# Altium project foc_driver-V0.5.PrjPcb
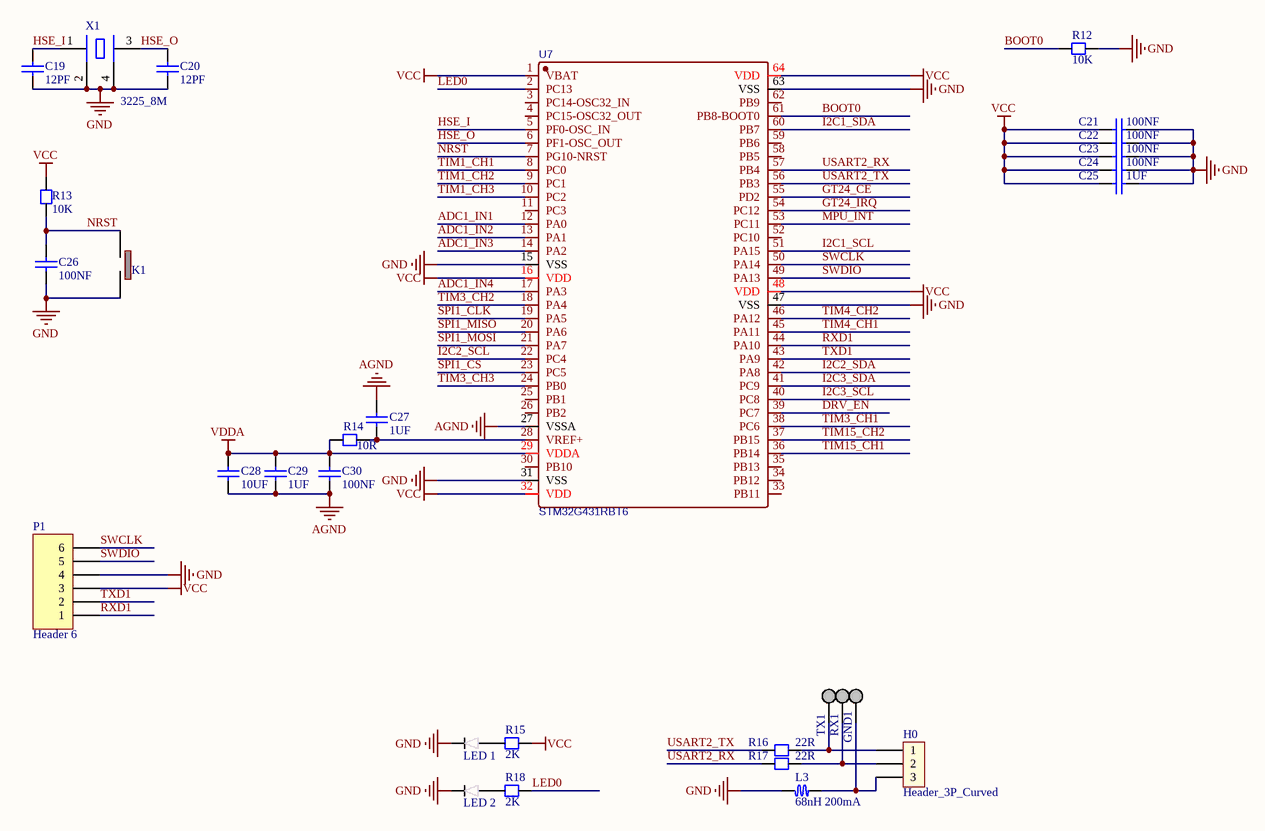
[diagram p0: Sheet0-MCU.SchDoc]
4 sheets, 116 parts. Net scope: global (net labels, ports and power ports of the same name join across sheets).
Board file: PCB.PcbDoc
Sheets:
  Sheet0-MCU.SchDoc
  Sheet1-driver.SchDoc
  Sheet2-sensor.SchDoc
  Sheet3-power.SchDoc

## Sheet Sheet0-MCU.SchDoc
size A3; SheetNumber: 1; SheetTotal: 4

### Parts
C19  12PF  [CC1608-0603]
C20  12PF  [CC1608-0603]
C21  100NF  [CC1608-0603]
C22  100NF  [CC1608-0603]
C23  100NF  [CC1608-0603]
C24  100NF  [CC1608-0603]
C25  1UF  [CC1608-0603]
C26  100NF  [CC1608-0603]
C27  1UF  [CC1608-0603]
C28  10UF  [CC1608-0603]
C29  1UF  [CC1608-0603]
C30  100NF  [CC1608-0603]
GND1  test  [test]  (value not drawn)
H0  Header_3P_Curved  [Header_2_54_3PW]
K1  KEY 3*4  [KEY 3*4]  (value not drawn)
L3  68nH 200mA  [Inductor-0603]
LED_1  LED 0603  [LED 0603]  (value not drawn)
LED_2  LED 0603  [LED 0603]  (value not drawn)
P1  Header 6  [HDR1X6]
R12  10K  [CR1608-0603]
R13  10K  [CR1608-0603]
R14  10R  [CR1608-0603]
R15  2K  [CR1608-0603]
R16  22R  [CR1608-0603]
R17  22R  [CR1608-0603]
R18  2K  [CR1608-0603]
RX1  test  [test]  (value not drawn)
TX1  test  [test]  (value not drawn)
U7  STM32G431RBT6  [LQFP-64]
X1  3225_8M  [XTAL-3225]

### Nets
AGND: C27.1 C28.1 C29.1 C30.1 U7.27(VSSA)
GND: C19.1 C20.1 C21.1 C22.1 C23.1 C24.1 C25.1 C26.1 K1.2 L3.2 LED_1.2 LED_2.2 P1.4 R12.1 U7.15(VSS) U7.31(VSS) U7.47(VSS) U7.63(VSS) X1.2(GND) X1.4(GND)
VCC: C21.2 C22.2 C23.2 C24.2 C25.2 P1.3 R13.2 R15.2 U7.1(VBAT) U7.16(VDD) U7.32(VDD) U7.48(VDD) U7.64(VDD)  [project net 3.3V]
VDDA: C28.2 C29.2 C30.2 R14.2 U7.29(VDDA)
ADC1_IN1: U7.12(PA0)
ADC1_IN2: U7.13(PA1)
ADC1_IN3: U7.14(PA2)
ADC1_IN4: U7.17(PA3)
BOOT0: R12.2 U7.61(PB8-BOOT0)
DRV_EN: U7.39(PC7)
GT24_CE: U7.55(PD2)
GT24_IRQ: U7.54(PC12)
HSE_I: C19.2 U7.5(PF0-OSC_IN) X1.1(OSC1)
HSE_O: C20.2 U7.6(PF1-OSC_OUT) X1.3(OSC2)
I2C1_SCL: U7.51(PA15)
I2C1_SDA: U7.60(PB7)
I2C2_SCL: U7.22(PC4)
I2C2_SDA: U7.42(PA8)
I2C3_SCL: U7.40(PC8)
I2C3_SDA: U7.41(PC9)
LED0: R18.2 U7.2(PC13)
MPU_INT: U7.53(PC11)
NRST: C26.2 K1.1 R13.1 U7.7(PG10-NRST)
RXD1: P1.1 U7.44(PA10)
SPI1_CLK: U7.19(PA5)
SPI1_CS: U7.23(PC5)
SPI1_MISO: U7.20(PA6)
SPI1_MOSI: U7.21(PA7)
SWCLK: P1.6 U7.50(PA14)
SWDIO: P1.5 U7.49(PA13)
TIM1_CH1: U7.8(PC0)
TIM1_CH2: U7.9(PC1)
TIM1_CH3: U7.10(PC2)
TIM3_CH1: U7.38(PC6)
TIM3_CH2: U7.18(PA4)
TIM3_CH3: U7.24(PB0)
TIM4_CH1: U7.45(PA11)
TIM4_CH2: U7.46(PA12)
TIM15_CH1: U7.36(PB14)
TIM15_CH2: U7.37(PB15)
TXD1: P1.2 U7.43(PA9)
USART2_RX: R17.1 U7.57(PB4)
USART2_TX: R16.1 U7.56(PB3)
NetC27_2: C27.2 R14.1 U7.28(VREF+)
NetGND1_0: GND1.0 H0.3 L3.1
NetH0_1: H0.1 R16.2 TX1.0
NetH0_2: H0.2 R17.2 RX1.0
NetLED_1_1: LED_1.1 R15.1
NetLED_2_1: LED_2.1 R18.1

Not connected (* = marked no-connect by the designer): U7 3(PC14-OSC32_IN) 4(PC15-OSC32_OUT) 11(PC3) 25(PB1) 26(PB2) 30(PB10) 33(PB11) 34(PB12) 35(PB13) 52(PC10) 58(PB5) 59(PB6) 62(PB9)

### Library data of the parts
C19-C30 = Cap Chip 0603: 0603封装的电容; Published: 8-Jun-2000; Revision: July-2002: Re-released for DXP Platform.; Publisher: Altium Limited
GND1 RX1 TX1 = test: 测试点
H0 = Header_3P_Curved: 弯的3P排针
K1 = KEY 3*4: 轻触开关按键
L3 = Inductor-0603: 贴片电感 0603封装
P1 = Header 6: Header, 6-Pin; LatestRevisionDate: 17-Jul-2002; LatestRevisionNote: Re-released for DXP Platform.; Publisher: Altium Limited
R12-R18 = Resistor Chip 0603: 0603封装电阻; Published: 8-Jun-2000; Revision: July-2002: Re-released for DXP Platform.; Publisher: Altium Limited
U7 = STM32G431RBT6: Manufacturer: ST(意法半导体); Contributor: LCSC; Supplier: LCSC; Supplier Part: C431633; Manufacturer Part: STM32G431RBT6; JLCPCB Part Class: Extended Part; spicePre: U; spiceSymbolName: STM32G431RBT6
X1 = XTAL 3225: 3225封装的晶振

## Sheet Sheet1-driver.SchDoc
size A3; SheetNumber: 2; SheetTotal: 4
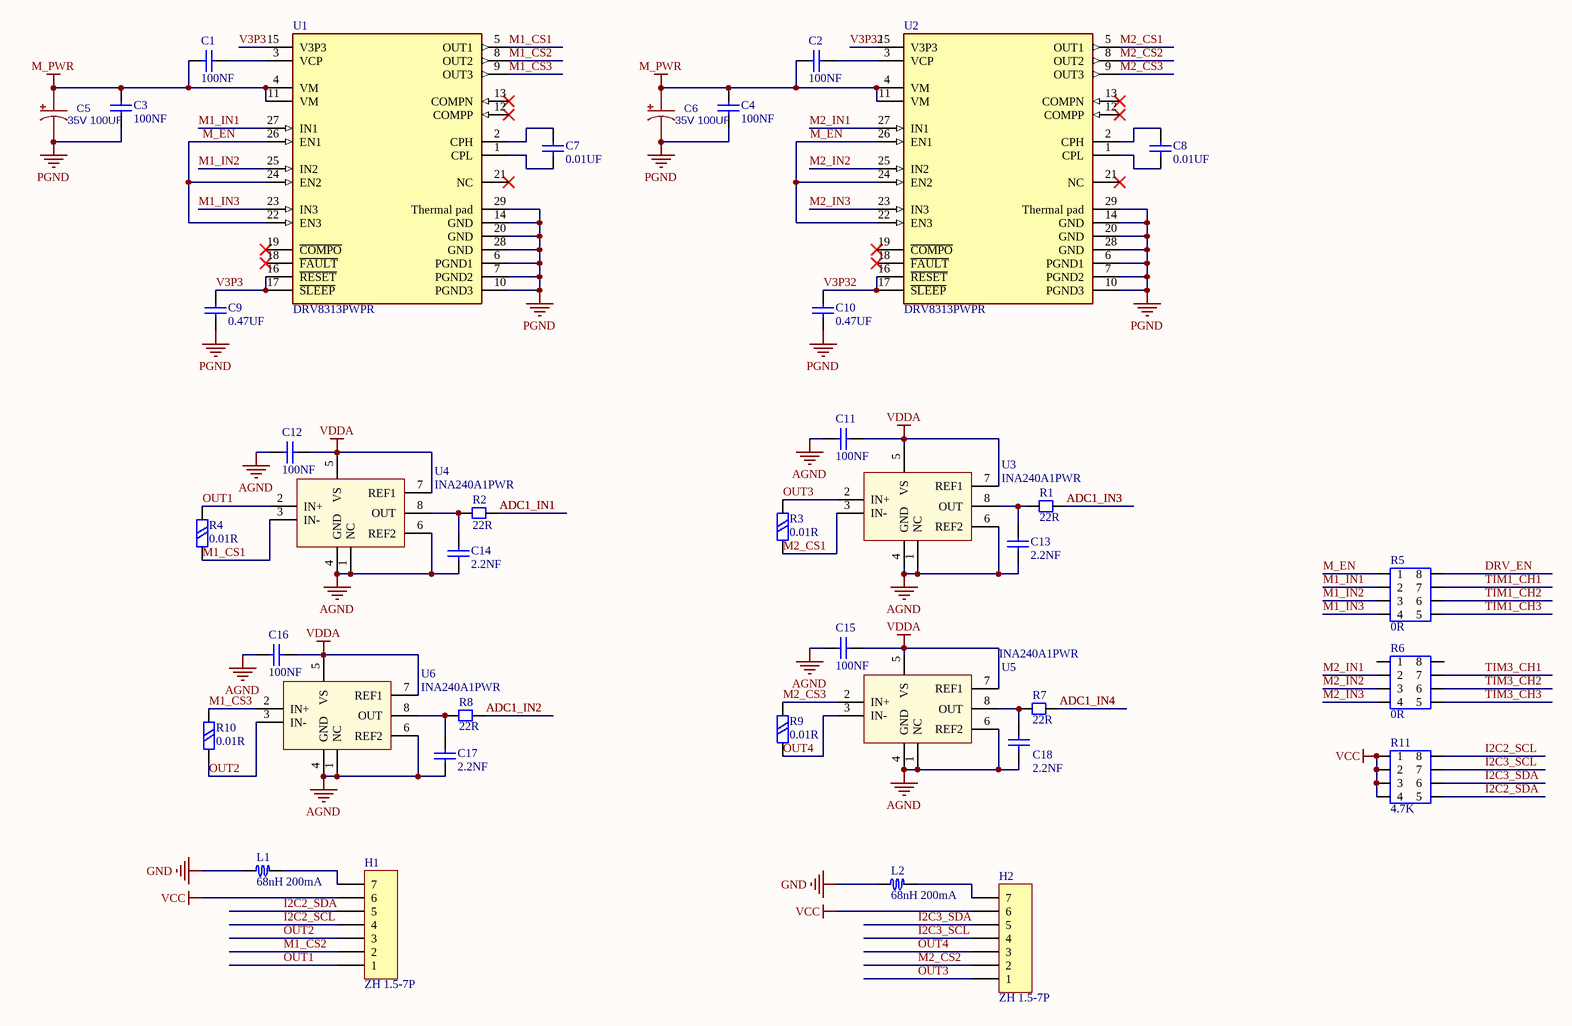
[diagram p1: Sheet1-driver.SchDoc]

### Parts
C1  100NF  [CC1608-0603]
C2  100NF  [CC1608-0603]
C3  100NF  [CC1608-0603]
C4  100NF  [CC1608-0603]
C5  35V 100UF  [CAP-SMD_D6.3]
C6  35V 100UF  [CAP-SMD_D6.3]
C7  0.01UF  [CC1608-0603]
C8  0.01UF  [CC1608-0603]
C9  0.47UF  [CC1608-0603]
C10  0.47UF  [CC1608-0603]
C11  100NF  [CC1608-0603]
C12  100NF  [CC1608-0603]
C13  2.2NF  [CC1608-0603]
C14  2.2NF  [CC1608-0603]
C15  100NF  [CC1608-0603]
C16  100NF  [CC1608-0603]
C17  2.2NF  [CC1608-0603]
C18  2.2NF  [CC1608-0603]
H1  ZH 1.5-7P  [ZH1.5-7P]
H2  ZH 1.5-7P  [ZH1.5-7P]
L1  68nH 200mA  [Inductor-0603]
L2  68nH 200mA  [Inductor-0603]
R1  22R  [CR1608-0603]
R2  22R  [CR1608-0603]
R3  0.01R  [CR3216-1206]
R4  0.01R  [CR3216-1206]
R5  0R  [SMD_0603-8P]
R6  0R  [SMD_0603-8P]
R7  22R  [CR1608-0603]
R8  22R  [CR1608-0603]
R9  0.01R  [CR3216-1206]
R10  0.01R  [CR3216-1206]
R11  4.7K  [SMD_0603-8P]
U1  DRV8313PWPR  [HTSSOP-28]
U2  DRV8313PWPR  [HTSSOP-28]
U3  INA240A1PWR  [TSSOP-8]
U4  INA240A1PWR  [TSSOP-8]
U5  INA240A1PWR  [TSSOP-8]
U6  INA240A1PWR  [TSSOP-8]

### Nets
AGND: C11.2 C12.2 C13.1 C14.1 C15.2 C16.2 C17.1 C18.1 U3.1(NC) U3.4(GND) U3.6(REF2) U4.1(NC) U4.4(GND) U4.6(REF2) U5.1(NC) U5.4(GND) U5.6(REF2) U6.1(NC) U6.4(GND) U6.6(REF2)
GND: L1.2 L2.2
M_PWR: C1.2 C2.2 C3.1 C4.1 C5.1 C6.1 U1.4(VM) U1.11(VM) U2.4(VM) U2.11(VM)
PGND: C3.2 C4.2 C5.2 C6.2 C9.2 C10.2 U1.6(PGND1) U1.7(PGND2) U1.10(PGND3) U1.14(GND) U1.20(GND) U1.28(GND) U1.29(Thermal_pad) U2.6(PGND1) U2.7(PGND2) U2.10(PGND3) U2.14(GND) U2.20(GND) U2.28(GND) U2.29(Thermal_pad)
VCC: H1.6 H2.6 R11.1 R11.2 R11.3 R11.4  [project net 3.3V]
VDDA: C11.1 C12.1 C15.1 C16.1 U3.5(VS) U3.7(REF1) U4.5(VS) U4.7(REF1) U5.5(VS) U5.7(REF1) U6.5(VS) U6.7(REF1)
ADC1_IN1: R2.1
ADC1_IN2: R8.1
ADC1_IN3: R1.1
ADC1_IN4: R7.1
DRV_EN: R5.8
I2C2_SCL: H1.4 R11.8
I2C2_SDA: H1.5 R11.5
I2C3_SCL: H2.4 R11.7
I2C3_SDA: H2.5 R11.6
M1_CS1: R4.1 U1.5(OUT1) U4.3(IN-)
M1_CS2: H1.2 U1.8(OUT2)
M1_CS3: R10.2 U1.9(OUT3) U6.2(IN+)
M1_IN1: R5.2 U1.27(IN1)
M1_IN2: R5.3 U1.25(IN2)
M1_IN3: R5.4 U1.23(IN3)
M2_CS1: R3.1 U2.5(OUT1) U3.3(IN-)
M2_CS2: H2.2 U2.8(OUT2)
M2_CS3: R9.2 U2.9(OUT3) U5.2(IN+)
M2_IN1: R6.2 U2.27(IN1)
M2_IN2: R6.3 U2.25(IN2)
M2_IN3: R6.4 U2.23(IN3)
M_EN: R5.1 U1.22(EN3) U1.24(EN2) U1.26(EN1) U2.22(EN3) U2.24(EN2) U2.26(EN1)
OUT1: H1.1 R4.2 U4.2(IN+)
OUT2: H1.3 R10.1 U6.3(IN-)
OUT3: H2.1 R3.2 U3.2(IN+)
OUT4: H2.3 R9.1 U5.3(IN-)
TIM1_CH1: R5.7
TIM1_CH2: R5.6
TIM1_CH3: R5.5
TIM3_CH1: R6.7
TIM3_CH2: R6.6
TIM3_CH3: R6.5
V3P3: C9.1 U1.15(V3P3) U1.16(~{RESET}) U1.17(~{SLEEP})
V3P32: C10.1 U2.15(V3P3) U2.16(~{RESET}) U2.17(~{SLEEP})
NetC1_1: C1.1 U1.3(VCP)
NetC2_1: C2.1 U2.3(VCP)
NetC7_1: C7.1 U1.2(CPH)
NetC7_2: C7.2 U1.1(CPL)
NetC8_1: C8.1 U2.2(CPH)
NetC8_2: C8.2 U2.1(CPL)
NetC13_2: C13.2 R1.2 U3.8(OUT)
NetC14_2: C14.2 R2.2 U4.8(OUT)
NetC17_2: C17.2 R8.2 U6.8(OUT)
NetC18_2: C18.2 R7.2 U5.8(OUT)
NetH1_7: H1.7 L1.1
NetH2_7: H2.7 L2.1

Not connected (* = marked no-connect by the designer): R6 1 8; U1 12(COMPP)* 13(COMPN)* 18(~{FAULT})* 19(~{COMPO})* 21(NC)*; U2 12(COMPP)* 13(COMPN)* 18(~{FAULT})* 19(~{COMPO})* 21(NC)*

### Library data of the parts
C1-C4 C7-C18 = Cap Chip 0603: 0603封装的电容; Published: 8-Jun-2000; Revision: July-2002: Re-released for DXP Platform.; Publisher: Altium Limited
C5 C6 = Cap ECAP SMD: 铝点解电容; BOM_Manufacturer: PANASONIC; BOM_Manufacturer Part: EEEFP1C681AP; nameAlias: Capacitance; Contributor: LCSC; BOM_Supplier: LCSC; BOM_Supplier Part: C413527; spicePre: C; spiceSymbolName: EEEFP1C681AP
H1 H2 = ZH 1.5-7P: ZH1.5-7P 间距1.5的贴片连接座
L1 L2 = Inductor-0603: 贴片电感 0603封装
R1 R2 R7 R8 = Resistor Chip 0603: 0603封装电阻; Published: 8-Jun-2000; Revision: July-2002: Re-released for DXP Platform.; Publisher: Altium Limited
R3 R4 R9 R10 = Resistor Chip 1206: 1206封装电阻; Published: 8-Jun-2000; Revision: July-2002: Re-released for DXP Platform.; Publisher: Altium Limited
R5 R6 R11 = Resistor Chip 0603_1206: 0603封装电阻; Published: 8-Jun-2000; Revision: July-2002: Re-released for DXP Platform.; Publisher: Altium Limited
U1 U2 = DRV8313: 独立控制的半 H 桥驱动器,主要用于驱动一个三项无刷电机IC MOTOR DRIVER 8V-60V 28HTSSOP; Min Supply Voltage: 8V; Max Supply Voltage: 60V; Number of Outputs: 1; Output Current: 1.75A; Interface: Parallel; Logic Function: AND GATE; Min Operating Temperature: -40°C; Max Operating Temperature: 125°C; Mount: Surface Mount; Lead Free: Lead Free; Package Quantity: 2000; Number of Pins: 28; Case/Package: HTSSOP; Series: -; Packaging: Tape and Reel
U3-U6 = INA240A1PWR: 超精密电流检测放大器

## Sheet Sheet2-sensor.SchDoc
size A4; SheetNumber: 3; SheetTotal: 4
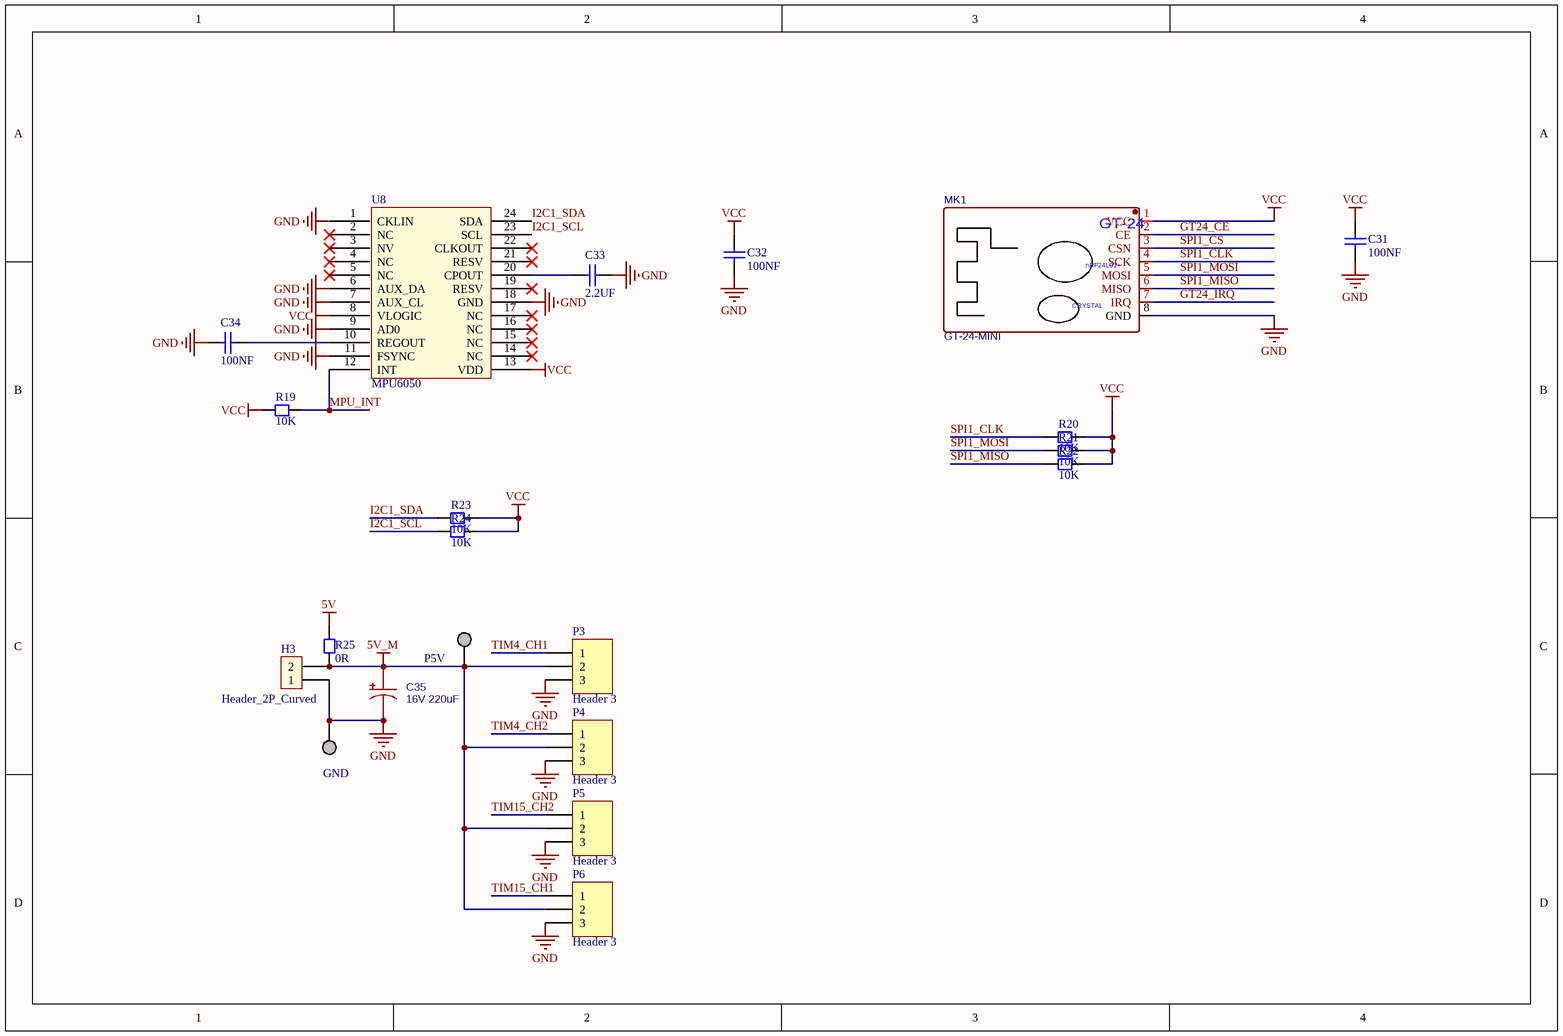
[diagram p2: Sheet2-sensor.SchDoc]

### Parts
C31  100NF  [CC1608-0603]
C32  100NF  [CC1608-0603]
C33  2.2UF  [CC1608-0603]
C34  100NF  [CC1608-0603]
C35  16V 220uF  [CAP-SMD_D6.3]
GND  test  [test]  (value not drawn)
H3  Header_2P_Curved  [Header_2_54_2PW]
MK1  GT-24-MINI  [GT24 _MINI]
P3  Header 3  [HDR1X3]
P4  Header 3  [HDR1X3]
P5  Header 3  [HDR1X3]
P5V  test  [test]  (value not drawn)
P6  Header 3  [HDR1X3]
R19  10K  [CR1608-0603]
R20  10K  [CR1608-0603]
R21  10K  [CR1608-0603]
R22  10K  [CR1608-0603]
R23  10K  [CR1608-0603]
R24  10K  [CR1608-0603]
R25  0R  [CR1608-0603]
U8  MPU6050  [QFN24 - duplicate]

### Nets
5V: R25.1
5V_M: C35.1 H3.2 P3.2 P4.2 P5.2 P5V.0 P6.2 R25.2
GND: C31.2 C32.2 C33.2 C34.1 C35.2 GND.0 H3.1 MK1.8(GND) P3.3 P4.3 P5.3 P6.3 U8.1(CKLIN) U8.6(AUX_DA) U8.7(AUX_CL) U8.9(AD0) U8.11(FSYNC) U8.18(GND)
VCC: C31.1 C32.1 MK1.1(VCC) R19.2 R20.1 R21.1 R22.1 R23.1 R24.1 U8.8(VLOGIC) U8.13(VDD)  [project net 3.3V]
GT24_CE: MK1.2(CE)
GT24_IRQ: MK1.7(IRQ)
I2C1_SCL: R24.2 U8.23(SCL)
I2C1_SDA: R23.2 U8.24(SDA)
MPU_INT: R19.1 U8.12(INT)
SPI1_CLK: MK1.4(SCK) R20.2
SPI1_CS: MK1.3(CSN)
SPI1_MISO: MK1.6(MISO) R22.2
SPI1_MOSI: MK1.5(MOSI) R21.2
TIM4_CH1: P3.1
TIM4_CH2: P4.1
TIM15_CH1: P6.1
TIM15_CH2: P5.1
NetC33_1: C33.1 U8.20(CPOUT)
NetC34_2: C34.2 U8.10(REGOUT)

Not connected (* = marked no-connect by the designer): U8 2(NC)* 3(NV)* 4(NC)* 5(NC)* 14(NC)* 15(NC)* 16(NC)* 17(NC)* 19(RESV)* 21(RESV)* 22(CLKOUT)*

### Notes on the sheet
- (in symbol GT-24-MINI) GT-24; nRF24L01+; CRYSTAL

### Library data of the parts
C31-C34 = Chip capacitor: 贴片电容
C35 = Cap ECAP SMD: as C5 on sheet Sheet1-driver; BOM_Supplier: LCSC; BOM_Supplier Part: C413527; spicePre: C; spiceSymbolName: EEEFP1C681AP
GND P5V = test: 测试点
H3 = Header_2P_Curved: 弯的2P排针
MK1 = GT-24-MINI: 工业级GT-24数传无线模块 2.4G NRF24L01&PA+LNA; Manufacturer: Ashining(泽耀科技); Manufacturer Part: AS01-ML01S; Supplier: LCSC; Supplier Part: C84802; JLCPCB Part Class: Extended Part; spicePre: M; spiceSymbolName: AS01-ML01S
P3-P6 = Header 3: Header, 3-Pin; LatestRevisionDate: 17-Jul-2002; LatestRevisionNote: Re-released for DXP Platform.; Publisher: Altium Limited
R19-R25 = Chip resistor: 贴片电阻
U8 = MPU6050: 陀螺仪

## Sheet Sheet3-power.SchDoc
size A4; SheetNumber: 4; SheetTotal: 4
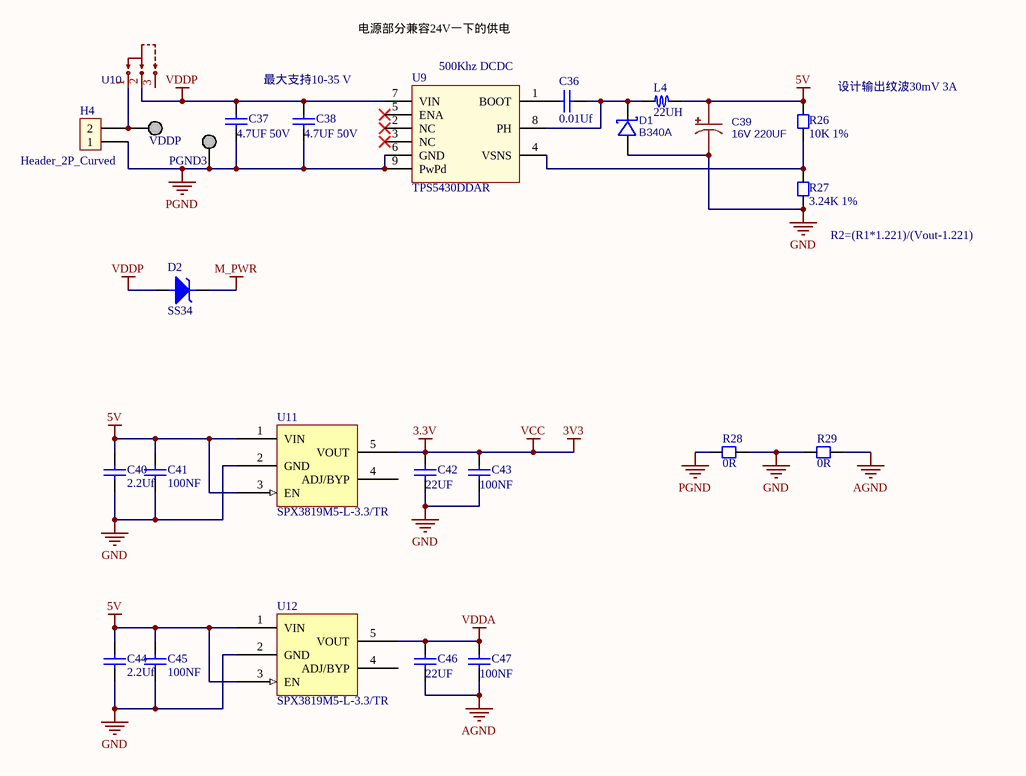
[diagram p3: Sheet3-power.SchDoc]

### Parts
C36  0.01Uf  [CC1608-0603]
C37  4.7UF 50V  [CC1608-0603]
C38  4.7UF 50V  [CC1608-0603]
C39  16V 220UF  [CAP-SMD_D6.3]
C40  2.2Uf  [CC1608-0603]
C41  100NF  [CC1608-0603]
C42  22UF  [CC1608-0603]
C43  100NF  [CC1608-0603]
C44  2.2Uf  [CC1608-0603]
C45  100NF  [CC1608-0603]
C46  22UF  [CC1608-0603]
C47  100NF  [CC1608-0603]
D1  B340A  [DO-214 AA]
D2  SS34  [DO-214 AA]
H4  Header_2P_Curved  [Header_2_54_2PW]
L4  22UH  [Inductor-1040]
PGND3  test  [test]  (value not drawn)
R26  10K 1%  [CR1608-0603]
R27  3.24K 1%  [CR1608-0603]
R28  0R  [CR1608-0603]
R29  0R  [CR1608-0603]
U9  TPS5430DDAR  [SOIC-8-E]
U10  HX SS12D10G4  [SW-TH_3P-SS12D06]  (value not drawn)
U11  SPX3819M5-L-3.3/TR  [SOT23-5]
U12  SPX3819M5-L-3.3/TR  [SOT23-5]
VDDP  test  [test]  (value not drawn)

### Nets
3.3V: C42.1 C43.1 U11.5(VOUT)  [also labelled 3V3, VCC]
5V: C39.1 C40.2 C41.2 C44.2 C45.2 L4.2 R26.2 U11.1(VIN) U11.3(EN) U12.1(VIN) U12.3(EN)
AGND: C46.2 C47.2 R29.1
GND: C39.2 C40.1 C41.1 C42.2 C43.2 C44.1 C45.1 D1.2(A) R27.1 R28.1 R29.2 U11.2(GND) U12.2(GND)
M_PWR: D2.1(K)
PGND: C37.2 C38.2 H4.1 PGND3.0 R28.2 U9.6(GND) U9.9(PwPd)
VDDA: C46.1 C47.1 U12.5(VOUT)
VDDP: C37.1 C38.1 D2.2(A) U9.7(VIN) U10.2
NetC36_1: C36.1 U9.1(BOOT)
NetC36_2: C36.2 D1.1(K) L4.1 U9.8(PH)
NetH4_2: H4.2 U10.1 VDDP.0
NetR26_1: R26.1 R27.2 U9.4(VSNS)

Not connected (* = marked no-connect by the designer): U9 2(NC)* 3(NC)* 5(ENA)*; U10 3; U11 4(ADJ/BYP); U12 4(ADJ/BYP)

### Notes on the sheet
- 电源部分兼容24V一下的供电
- 最大支持10-35 V
- (near U9) 500Khz DCDC
- (near R26) 设计输出纹波30mV 3A
- (near R27) R2=(R1*1.221)/(Vout-1.221)

### Library data of the parts
C36-C38 C42 C43 C46 C47 = Chip capacitor: 贴片电容
C39 = Cap ECAP SMD: as C5 on sheet Sheet1-driver; BOM_Supplier: LCSC; BOM_Supplier Part: C413527; spicePre: C; spiceSymbolName: EEEFP1C681AP
C40 C41 C44 C45 = Cap Chip 0603: 0603封装的电容; Published: 8-Jun-2000; Revision: July-2002: Re-released for DXP Platform.; Publisher: Altium Limited
D1 = B340A: 40V 3A 550mV@3A; BOM_Manufacturer: MDD; BOM_Supplier: LCSC; BOM_Manufacturer Part: B340A; BOM_Supplier Part: C64982; BOM_JLCPCB Part Class: Extended Part; spicePre: D; spiceSymbolName: B340A
D2 = SS34: 肖特基二极管
H4 = Header_2P_Curved: 弯的2P排针
L4 = Inductor-1040: 1040封装 一体成型 贴片 功率电感
PGND3 VDDP = test: 测试点
R26 R27 = Chip resistor: 贴片电阻
R28 R29 = Resistor Chip 0603: 0603封装电阻; Published: 8-Jun-2000; Revision: July-2002: Re-released for DXP Platform.; Publisher: Altium Limited
U9 = TPS5430DDAR: 宽电压DCDC降压IC
U10 = SW-TH_3P-SS12D06: BOM_Manufacturer: hanxia(韩下); Contributor: lcsc; BOM_Supplier: LCSC; BOM_Supplier Part: C5149841; BOM_Manufacturer Part: HX SS12D10G4; link: https://atta.szlcsc.com/upload/public/pdf/source/20220907/2020D7183ED16DD6E2B9F5A13FB144CF.pdf; BOM_JLCPCB Part Class: Extended Part; spicePre: U; spiceSymbolName: HX SS12D10G4
U11 U12 = SPX3819M5-L-3.3/TR: LDO 3.3V , SOT-23-5 500ma

## Nets that join several sheets
3.3V: Sheet0-MCU (13 pins), Sheet1-driver (6 pins), Sheet2-sensor (11 pins), Sheet3-power (C42.1 C43.1 U11.5)
5V: Sheet2-sensor (R25.1), Sheet3-power (11 pins)
AGND: Sheet0-MCU (5 pins), Sheet1-driver (20 pins), Sheet3-power (C46.2 C47.2 R29.1)
GND: Sheet0-MCU (20 pins), Sheet1-driver (L1.2 L2.2), Sheet2-sensor (18 pins), Sheet3-power (13 pins)
M_PWR: Sheet1-driver (10 pins), Sheet3-power (D2.1)
PGND: Sheet1-driver (20 pins), Sheet3-power (7 pins)
VDDA: Sheet0-MCU (5 pins), Sheet1-driver (12 pins), Sheet3-power (C46.1 C47.1 U12.5)
ADC1_IN1: Sheet0-MCU (U7.12), Sheet1-driver (R2.1)
ADC1_IN2: Sheet0-MCU (U7.13), Sheet1-driver (R8.1)
ADC1_IN3: Sheet0-MCU (U7.14), Sheet1-driver (R1.1)
ADC1_IN4: Sheet0-MCU (U7.17), Sheet1-driver (R7.1)
DRV_EN: Sheet0-MCU (U7.39), Sheet1-driver (R5.8)
GT24_CE: Sheet0-MCU (U7.55), Sheet2-sensor (MK1.2)
GT24_IRQ: Sheet0-MCU (U7.54), Sheet2-sensor (MK1.7)
I2C1_SCL: Sheet0-MCU (U7.51), Sheet2-sensor (R24.2 U8.23)
I2C1_SDA: Sheet0-MCU (U7.60), Sheet2-sensor (R23.2 U8.24)
I2C2_SCL: Sheet0-MCU (U7.22), Sheet1-driver (H1.4 R11.8)
I2C2_SDA: Sheet0-MCU (U7.42), Sheet1-driver (H1.5 R11.5)
I2C3_SCL: Sheet0-MCU (U7.40), Sheet1-driver (H2.4 R11.7)
I2C3_SDA: Sheet0-MCU (U7.41), Sheet1-driver (H2.5 R11.6)
MPU_INT: Sheet0-MCU (U7.53), Sheet2-sensor (R19.1 U8.12)
SPI1_CLK: Sheet0-MCU (U7.19), Sheet2-sensor (MK1.4 R20.2)
SPI1_CS: Sheet0-MCU (U7.23), Sheet2-sensor (MK1.3)
SPI1_MISO: Sheet0-MCU (U7.20), Sheet2-sensor (MK1.6 R22.2)
SPI1_MOSI: Sheet0-MCU (U7.21), Sheet2-sensor (MK1.5 R21.2)
TIM1_CH1: Sheet0-MCU (U7.8), Sheet1-driver (R5.7)
TIM1_CH2: Sheet0-MCU (U7.9), Sheet1-driver (R5.6)
TIM1_CH3: Sheet0-MCU (U7.10), Sheet1-driver (R5.5)
TIM3_CH1: Sheet0-MCU (U7.38), Sheet1-driver (R6.7)
TIM3_CH2: Sheet0-MCU (U7.18), Sheet1-driver (R6.6)
TIM3_CH3: Sheet0-MCU (U7.24), Sheet1-driver (R6.5)
TIM4_CH1: Sheet0-MCU (U7.45), Sheet2-sensor (P3.1)
TIM4_CH2: Sheet0-MCU (U7.46), Sheet2-sensor (P4.1)
TIM15_CH1: Sheet0-MCU (U7.36), Sheet2-sensor (P6.1)
TIM15_CH2: Sheet0-MCU (U7.37), Sheet2-sensor (P5.1)